# Altium schematic sheet MainSchematic.SchDoc
size A; Date: 11/06/2022; Author: Enrique Morell; DrawnBy: Enrique Morell; SheetNumber: 1; SheetTotal: 1; Version: 1.0
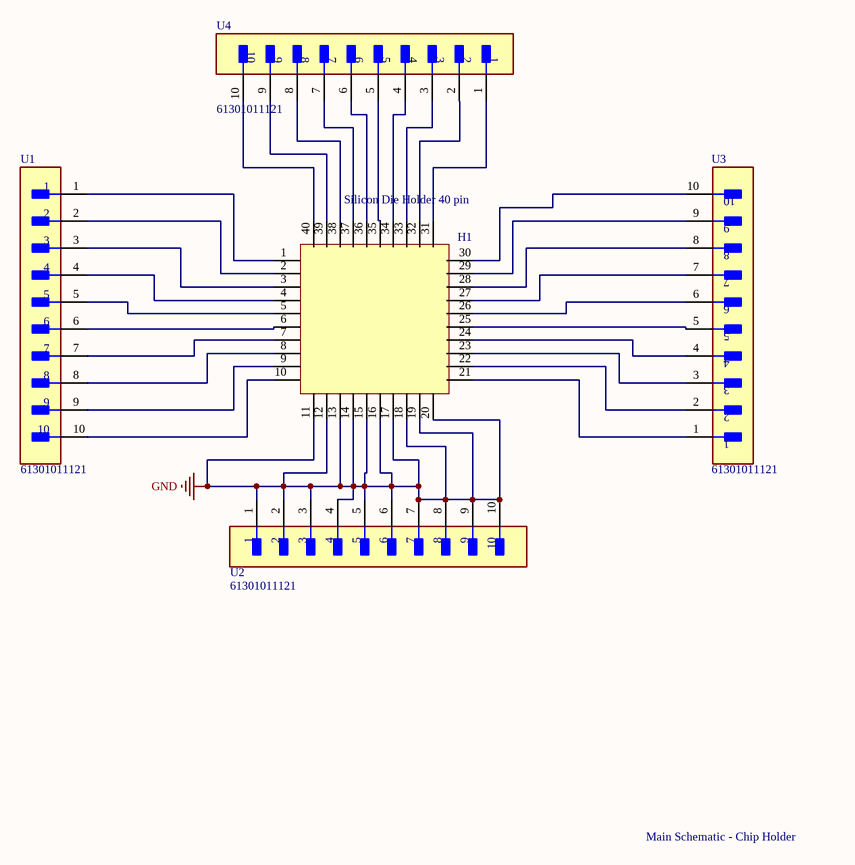
[diagram p0: MainSchematic.SchDoc]

## Parts
H1  Silicon Die Holder 40 pin  [CQFP200P2508X2508X310-40N]
U1  61301011121  [FP-61301011121-MFG]
U2  61301011121  [FP-61301011121-MFG]
U3  61301011121  [FP-61301011121-MFG]
U4  61301011121  [FP-61301011121-MFG]

## Nets
GND: H1.11 H1.12 H1.13 H1.14 H1.15 H1.16 H1.17 H1.18 H1.19 H1.20 U2.1 U2.2 U2.3 U2.4 U2.5 U2.6 U2.7 U2.8 U2.9 U2.10
NetH1_1: H1.1 U1.1
NetH1_2: H1.2 U1.2
NetH1_3: H1.3 U1.3
NetH1_4: H1.4 U1.4
NetH1_5: H1.5 U1.5
NetH1_6: H1.6 U1.6
NetH1_7: H1.7 U1.7
NetH1_8: H1.8 U1.8
NetH1_9: H1.9 U1.9
NetH1_10: H1.10 U1.10
NetH1_21: H1.21 U3.1
NetH1_22: H1.22 U3.2
NetH1_23: H1.23 U3.3
NetH1_24: H1.24 U3.4
NetH1_25: H1.25 U3.5
NetH1_26: H1.26 U3.6
NetH1_27: H1.27 U3.7
NetH1_28: H1.28 U3.8
NetH1_29: H1.29 U3.9
NetH1_30: H1.30 U3.10
NetH1_31: H1.31 U4.1
NetH1_32: H1.32 U4.2
NetH1_33: H1.33 U4.3
NetH1_34: H1.34 U4.4
NetH1_35: H1.35 U4.5
NetH1_36: H1.36 U4.6
NetH1_37: H1.37 U4.7
NetH1_38: H1.38 U4.8
NetH1_39: H1.39 U4.9
NetH1_40: H1.40 U4.10

## Notes on the sheet
- Main Schematic - Chip Holder

## Library data of the parts
H1 = Silicon Die Holder 40 pin 20mm: Part Number: Silicon Die Holder 40 pin 20mm
U1-U4 = CMP-1502-01082-3: CONN HEADER VERT 10POS 2.54MM; Gender: Male; Insulation Resistance: 1GR; Number of Contacts: 10; Current Rating: 3A; Voltage Rating: 250V; Contact Mating Length: 0.236inch; Termination: Solder; Insulation Material: Nylon; Fastening Type: Pull; RoHS Compliant: Yes; Height: 11.54mm; Contact Plating: Gold; Series: WR-PHD; Length: 2.54mm; Mount: Through Hole; Contact Shape: Square; Package Quantity: 1000; Contact Gender: Male; Housing Material: PBT; Color: Black; Orientation: Straight; Number of Rows: 1; Connector Type: Header; Contact Type: Male Pin; Insulation Color: Black; Width: 25.4mm; Min Operating Temperature: -40°C; Contact Material: Copper Alloy; Number of Positions: 10; Contact Finish - Mating: GOLD; Pitch: 2.54mm; Flammability Rating: UL94 V-0; Max Operating Temperature: 105°C; Packaging: Bulk